# Altium project controller_V1.1.PrjPcb
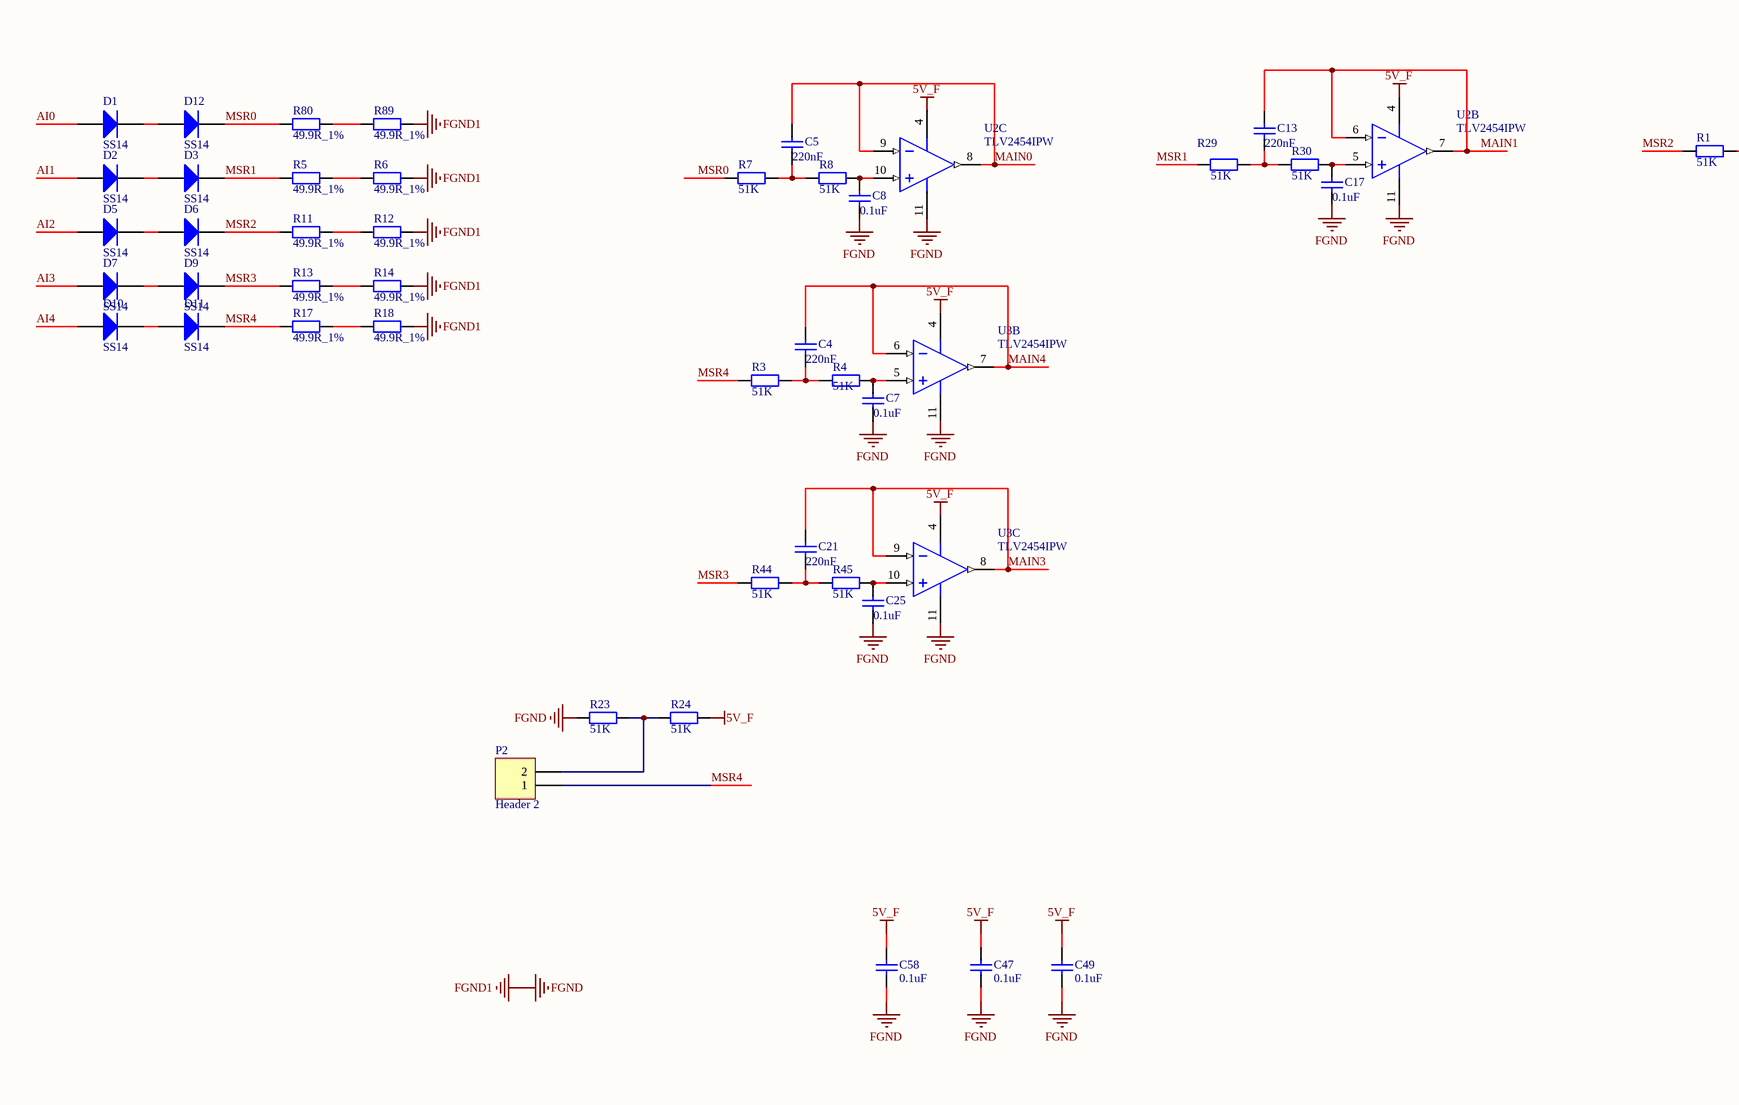
[diagram p0: ai.SchDoc, top left]
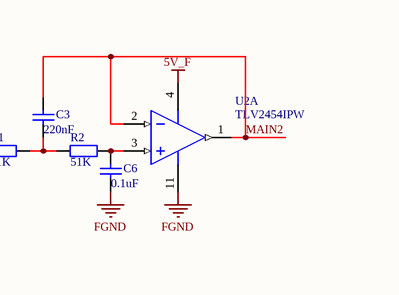
[diagram p1: ai.SchDoc, top right]
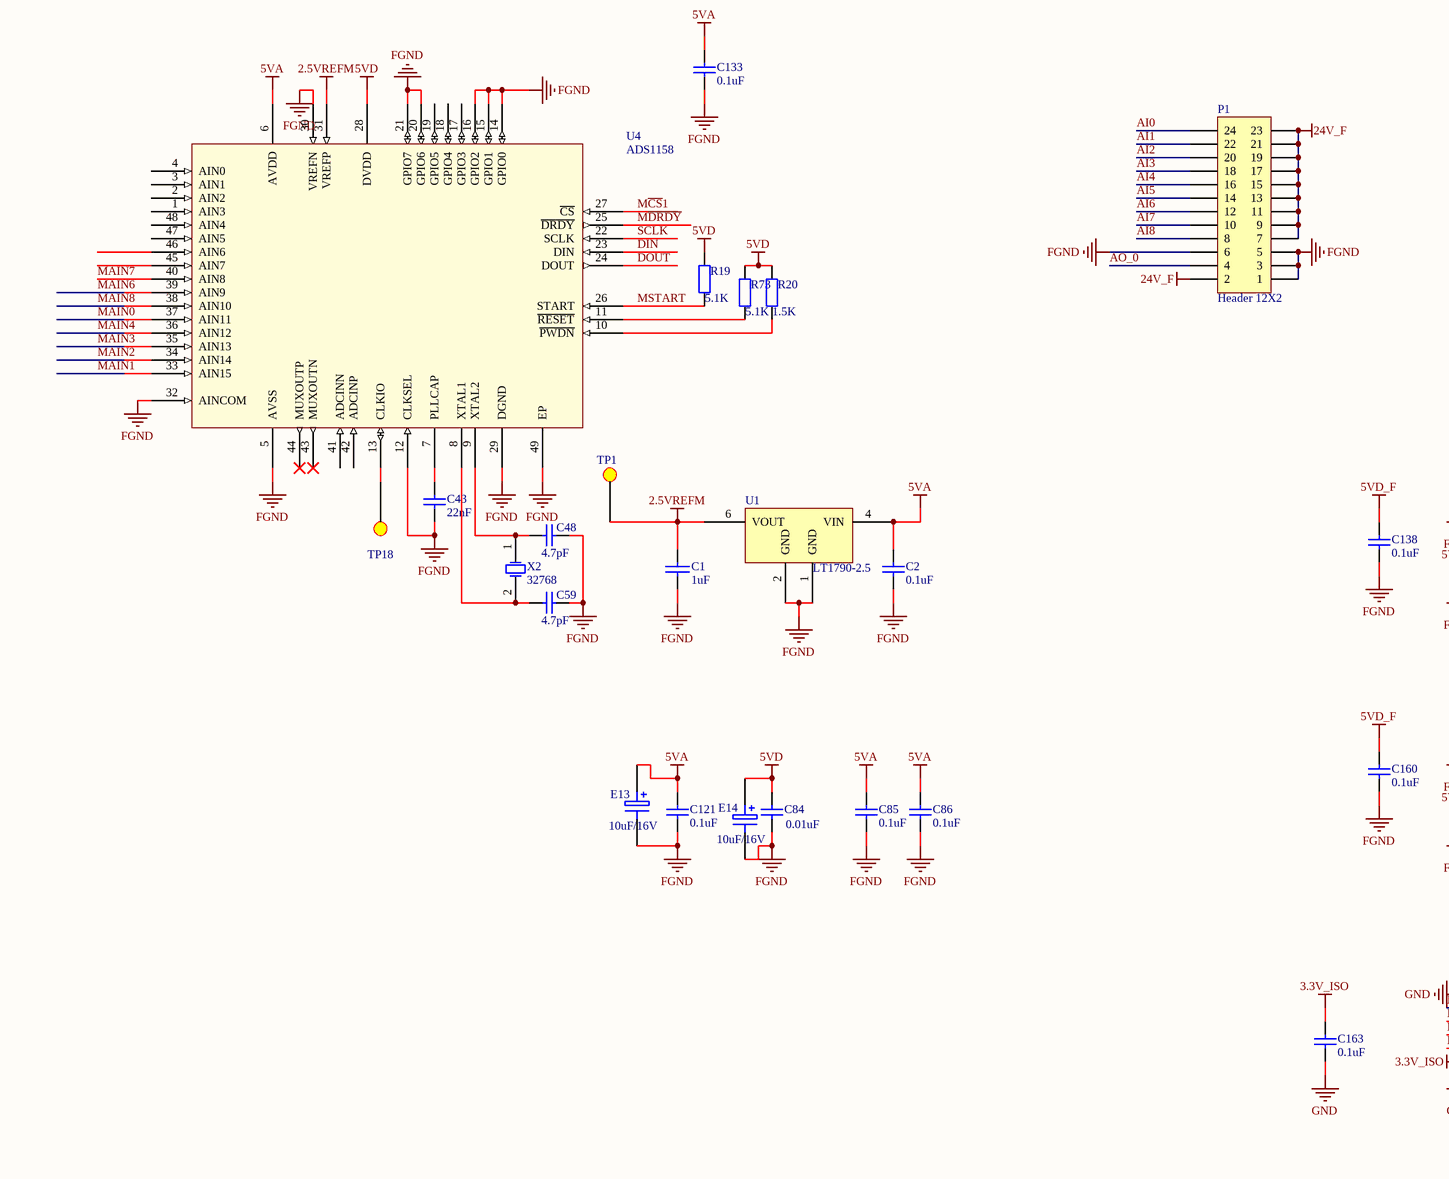
[diagram p2: ai.SchDoc, bottom left]
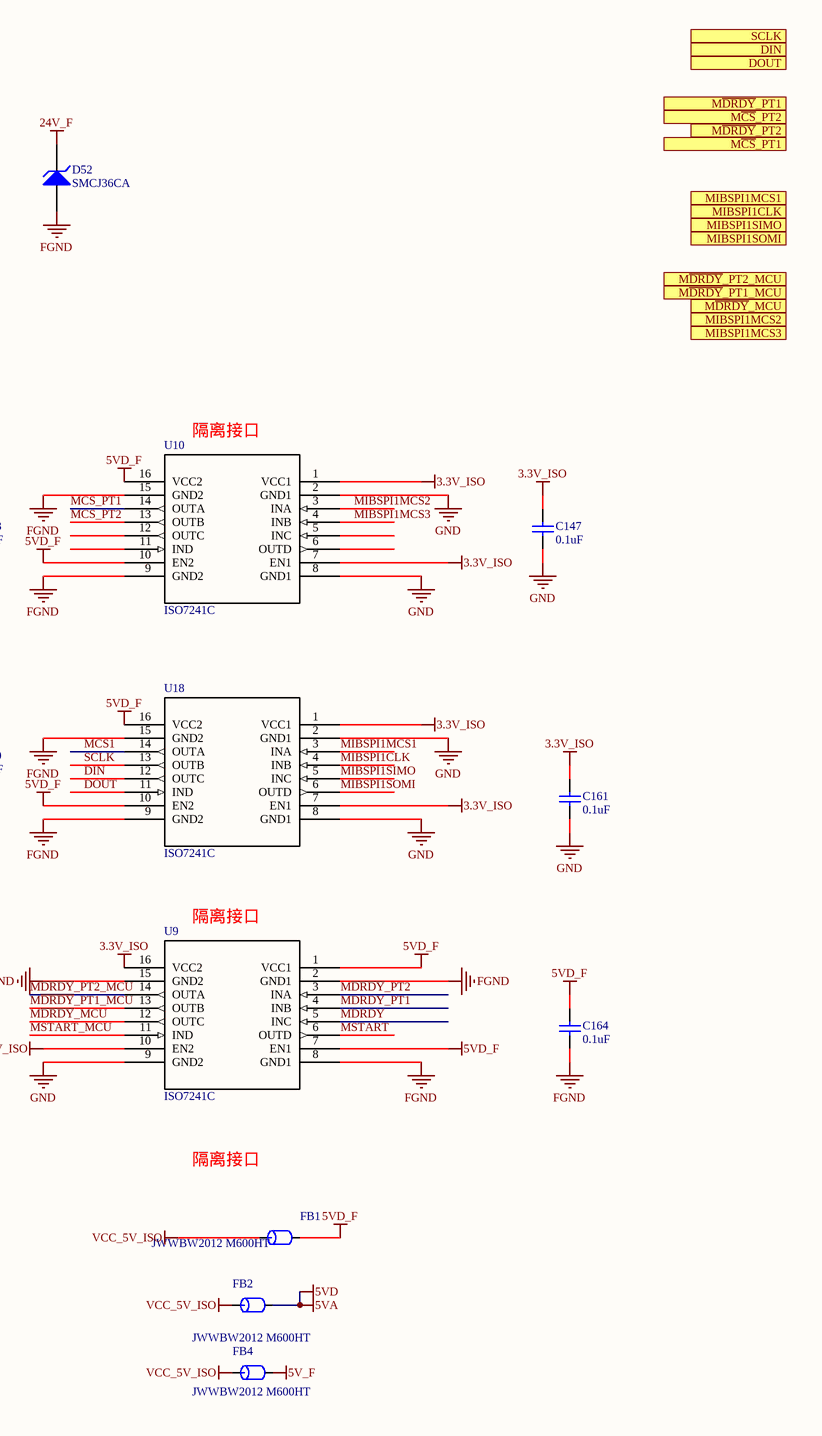
[diagram p3: ai.SchDoc, bottom right]
5 sheets, 182 parts. Net scope: global (net labels, ports and power ports of the same name join across sheets).
Board file: controller_V1.1.PcbDoc
Sheets:
  ai.SchDoc
  di.SchDoc
  IO_ctrl.SchDoc
  LTE.SchDoc
  power.SchDoc

## Sheet ai.SchDoc
size A1

### Parts
C1  1uF  [0603C]
C2  0.1uF  [0603C]
C3  220nF  [0805C]
C4  220nF  [0805C]
C5  220nF  [0805C]
C6  0.1uF  [0603C]
C7  0.1uF  [0603C]
C8  0.1uF  [0603C]
C13  220nF  [0805C]
C17  0.1uF  [0603C]
C21  220nF  [0805C]
C25  0.1uF  [0603C]
C43  22nF  [0805C]
C47  0.1uF  [0603C]
C48  4.7pF  [0603C]
C49  0.1uF  [0603C]
C58  0.1uF  [0603C]
C59  4.7pF  [0603C]
C84  0.01uF  [0603C]
C85  0.1uF  [0603C]
C86  0.1uF  [0603C]
C121  0.1uF  [0603C]
C133  0.1uF  [0603C]
C138  0.1uF  [0603C]
C147  0.1uF  [0603C]
C160  0.1uF  [0603C]
C161  0.1uF  [0603C]
C163  0.1uF  [0603C]
C164  0.1uF  [0603C]
D1  SS14  [DO-214AC]
D2  SS14  [DO-214AC]
D3  SS14  [DO-214AC]
D5  SS14  [DO-214AC]
D6  SS14  [DO-214AC]
D7  SS14  [DO-214AC]
D9  SS14  [DO-214AC]
D10  SS14  [DO-214AC]
D11  SS14  [DO-214AC]
D12  SS14  [DO-214AC]
D52  SMCJ36CA  [SMC]
E13  10uF/16V  [C3528]
E14  10uF/16V  [C3528]
FB1  JWWBW2012 M600HT  [0805R]
FB2  JWWBW2012 M600HT  [0805R]
FB4  JWWBW2012 M600HT  [0805R]
P1  Header 12X2  [XH2.54_2x12]
P2  Header 2  [HDR1X2]  (no BOM)
R1  51K  [0603R]
R2  51K  [0603R]
R3  51K  [0603R]
R4  51K  [0603R]
R5  49.9R_1%  [0805R]
R6  49.9R_1%  [0805R]
R7  51K  [0603R]
R8  51K  [0603R]
R11  49.9R_1%  [0805R]
R12  49.9R_1%  [0805R]
R13  49.9R_1%  [0805R]
R14  49.9R_1%  [0805R]
R17  49.9R_1%  [0805R]
R18  49.9R_1%  [0805R]
R19  5.1K  [0603R]
R20  1.5K  [0603R]
R23  51K  [0603R]
R24  51K  [0603R]
R29  51K  [0603R]
R30  51K  [0603R]
R44  51K  [0603R]
R45  51K  [0603R]
R73  5.1K  [0603R]
R80  49.9R_1%  [0805R]
R89  49.9R_1%  [0805R]
TP1  TEST_POINT  [TPD]  (value not drawn)
TP18  TEST_POINT  [TPD]  (value not drawn)
U1  LT1790-2.5  [SOT23-6]
U2  TLV2454IPW  [TSSOP14]  (parts A,B,C of 4)
U3  TLV2454IPW  [TSSOP14]  (parts B,C of 4)
U4  ADS1158  [S-PVFQN-N48]
U9  ISO7241C  [SOIC16]
U10  ISO7241C  [SOIC16]
U18  ISO7241C  [SOIC16]
X2  32768  [A]

### Ports
DIN (in), DOUT (out), MIBSPI1CLK (in), MIBSPI1MCS1 (in), MIBSPI1MCS2 (in), MIBSPI1MCS3 (in), MIBSPI1SIMO (in), MIBSPI1SOMI (out), M~{CS}_PT1 (out), M~{CS}_PT2 (out), M~{DRDY}_MCU (out), M~{DRDY}_PT1 (out), M~{DRDY}_PT1_MCU (out), M~{DRDY}_PT2 (out), M~{DRDY}_PT2_MCU (out), SCLK (in)

### Nets
2.5VREFM: C1.1 TP1.1 U1.6(VOUT) U4.31(VREFP)
3.3V_ISO: C147.2 C161.2 C163.2 U9.10(EN2) U9.16(VCC2) U10.1(VCC1) U10.7(EN1) U18.1(VCC1) U18.7(EN1)
5V_F: C47.2 C49.2 C58.2 FB4.2 R24.2 U2.4(V+) U3.4(V+)
5VA: C2.2 C84.2 C85.2 C86.2 C121.2 C133.2 E13.1 E14.1 FB2.2 R19.1 R20.1 R73.1 U1.4(VIN) U4.6(AVDD) U4.28(DVDD)  [also labelled 5VD]
5VD_F: C138.2 C160.2 C164.2 FB1.2 U9.1(VCC1) U9.7(EN1) U10.10(EN2) U10.16(VCC2) U18.10(EN2) U18.16(VCC2)
24V_F: D52.2(K) P1.2 P1.7 P1.9 P1.11 P1.13 P1.15 P1.17 P1.19 P1.21 P1.23
FGND: C1.2 C2.1 C6.1 C7.1 C8.1 C17.1 C25.1 C43.2 C47.1 C48.2 C49.1 C58.1 C59.2 C84.1 C85.1 C86.1 C121.1 C133.1 C138.1 C160.1 C164.1 D52.1(A) E13.2 E14.2 P1.1 P1.3 P1.5 P1.6 R6.1 R12.1 R14.1 R18.1 R23.1 R89.1 U1.1(GND) U1.2(GND) U2.11(GND) U3.11(GND) U4.5(AVSS) U4.12(CLKSEL) U4.14(GPIO0) U4.15(GPIO1) U4.16(GPIO2) U4.20(GPIO6) U4.21(GPIO7) U4.29(DGND) U4.30(VREFN) U4.32(AINCOM) U4.49(EP) U9.2(GND1) U9.8(GND1) U10.9(GND2) U10.15(GND2) U18.9(GND2) U18.15(GND2)  [also labelled FGND1]
GND: C147.1 C161.1 C163.1 U9.9(GND2) U9.15(GND2) U10.2(GND1) U10.8(GND1) U18.2(GND1) U18.8(GND1)
VCC_5V_ISO: FB1.1 FB2.1 FB4.1
AI0: D1.1(A) P1.24
AI1: D2.1(A) P1.22
AI2: D5.1(A) P1.20
AI3: D7.1(A) P1.18
AI4: D10.1(A) P1.16
AI5: P1.14
AI6: P1.12
AI7: P1.10
AI8: P1.8
AO_0: P1.4
DIN: U4.23(DIN) U18.12(OUTC)
DOUT: U4.24(DOUT) U18.11(IND)
MAIN0: C5.2 U2.8(OUT) U2.9(IN-) U4.37(AIN11)
MAIN1: C13.2 U2.6(IN-) U2.7(OUT) U4.33(AIN15)
MAIN2: C3.2 U2.1(OUT) U2.2(IN-) U4.34(AIN14)
MAIN3: C21.2 U3.8(OUT) U3.9(IN-) U4.35(AIN13)
MAIN4: C4.2 U3.6(IN-) U3.7(OUT) U4.36(AIN12)
MAIN6: U4.39(AIN9)
MAIN7: U4.40(AIN8)
MAIN8: U4.38(AIN10)
M~{CS}1: U4.27(~{CS}) U18.14(OUTA)
M~{CS}_PT1: U10.14(OUTA)
M~{CS}_PT2: U10.13(OUTB)
M~{DRDY}: U4.25(~{DRDY}) U9.5(INC)
M~{DRDY}_MCU: U9.12(OUTC)
M~{DRDY}_PT1: U9.4(INB)
M~{DRDY}_PT1_MCU: U9.13(OUTB)
M~{DRDY}_PT2: U9.3(INA)
M~{DRDY}_PT2_MCU: U9.14(OUTA)
MIBSPI1CLK: U18.4(INB)
MIBSPI1MCS1: U18.3(INA)
MIBSPI1MCS2: U10.3(INA)
MIBSPI1MCS3: U10.4(INB)
MIBSPI1SIMO: U18.5(INC)
MIBSPI1SOMI: U18.6(OUTD)
MSR0: D12.2(K) R7.2 R80.2
MSR1: D3.2(K) R5.2 R29.2
MSR2: D6.2(K) R1.2 R11.2
MSR3: D9.2(K) R13.2 R44.2
MSR4: D11.2(K) P2.1 R3.2 R17.2
MSTART: R19.2 U4.26(START) U9.6(OUTD)
MSTART_MCU: U9.11(IND)
SCLK: U4.22(SCLK) U18.13(OUTB)
NetC3_1: C3.1 R1.1 R2.2
NetC4_1: C4.1 R3.1 R4.2
NetC5_1: C5.1 R7.1 R8.2
NetC6_2: C6.2 R2.1 U2.3(IN+)
NetC7_2: C7.2 R4.1 U3.5(IN+)
NetC8_2: C8.2 R8.1 U2.10(IN+)
NetC13_1: C13.1 R29.1 R30.2
NetC17_2: C17.2 R30.1 U2.5(IN+)
NetC21_1: C21.1 R44.1 R45.2
NetC25_2: C25.2 R45.1 U3.10(IN+)
NetC43_1: C43.1 U4.7(PLLCAP)
NetC48_1: C48.1 U4.9(XTAL2) X2.1(OSC1)
NetC59_1: C59.1 U4.8(XTAL1) X2.2(OSC2)
NetD1_2: D1.2(K) D12.1(A)
NetD2_2: D2.2(K) D3.1(A)
NetD5_2: D5.2(K) D6.1(A)
NetD7_2: D7.2(K) D9.1(A)
NetD10_2: D10.2(K) D11.1(A)
NetP2_2: P2.2 R23.2 R24.1
NetR5_1: R5.1 R6.2
NetR11_1: R11.1 R12.2
NetR13_1: R13.1 R14.2
NetR17_1: R17.1 R18.2
NetR20_2: R20.2 U4.10(~{PWDN})
NetR73_2: R73.2 U4.11(~{RESET})
NetR80_1: R80.1 R89.2
NetTP18_1: TP18.1 U4.13(CLKIO)

Not connected (* = marked no-connect by the designer): U1 3(DNC) 5(DNC); U4 1(AIN3) 2(AIN2) 3(AIN1) 4(AIN0) 17(GPIO3) 18(GPIO4) 19(GPIO5) 41(ADCINN) 42(ADCINP) 43(MUXOUTN)* 44(MUXOUTP)* 45(AIN7) 46(AIN6) 47(AIN5) 48(AIN4); U10 5(INC) 6(OUTD) 11(IND) 12(OUTC)

### Notes on the sheet
- (near U10) 隔离接口
- (near U9) 隔离接口
- 隔离接口

### Library data of the parts
C1 = CAP: Capacitor
C2-C8 C13 C17 C21 C25 C43 C47-C49 C58 C84-C86 C121 C133 C138 C147 C160 C161 C163 C164 = Cap: Capacitor; Published: 8-Jun-2000; LatestRevisionDate: 17-Jul-2002; LatestRevisionNote: Re-released for DXP Platform.; PackageReference: RAD-0.3; Publisher: Altium Limited; PackageDescription: Radial Cap, Thru-Hole; 2 Leads; 0.3 in Pin Spacing
  C2 C47 C49 C58 C85 C86 C121 C133 C138 C147 C160 C161 C163 C164: Value: 0.1uF
C59 = Cap: Capacitor; Value: 6.8pF; Published: 8-Jun-2000; LatestRevisionDate: 17-Jul-2002; LatestRevisionNote: Re-released for DXP Platform.; PackageReference: RAD-0.3; Publisher: Altium Limited; PackageDescription: Radial Cap, Thru-Hole; 2 Leads; 0.3 in Pin Spacing
D1-D3 D5-D7 D9-D12 = Diode: Default Diode; Published: 8-Jun-2000; LatestRevisionDate: 17-Jul-2002; LatestRevisionNote: Re-released for DXP Platform.; PackageVersion: Sep-1996; PackageReference: SMC; Publisher: Altium Limited; Code_JEDEC: DO-214-AB
D52 = D Zener: SMBJ36CA; Published: 8-Jun-2000; LatestRevisionDate: 17-Jul-2002; LatestRevisionNote: Re-released for DXP Platform.; PackageReference: DIODE-0.7; Publisher: Altium Limited
E13 E14 = ELECTRO1: Electrolytic Capacitor
FB1 FB2 FB4 = FB: Part Field 1: 磁珠/0603/1K ohm/100MHz; FB: BLM18BD102SN1(muRata); Text Field1: FB
P1 = Header 12X2: Header, 12-Pin, Dual row; LatestRevisionDate: 17-Jul-2002; LatestRevisionNote: Re-released for DXP Platform.; Publisher: Altium Limited
P2 = Header 2: Header, 2-Pin; LatestRevisionDate: 17-Jul-2002; LatestRevisionNote: Re-released for DXP Platform.; Publisher: Altium Limited
R1-R8 R11-R14 R17-R20 R23 R24 R29 R30 R44 R45 R73 R80 R89 = Res0805M
U1 = LT1790-2.5: 2.5V Micropower SOT-23  Low Dropout Reference
U2 U3 = MAX908EPD: Quad High-speed, Ultra Low-power, Single-Supply TTL comparator; Published: 16-Jan-2001; LatestRevisionDate: 29-May-2009; LatestRevisionNote: Component Body Added.; DatasheetVersion: Jul-1994; PackageVersion: RevB, 21-0043; PackageReference: PD14; Publisher: Altium Limited; PackageDescription: DIP, 14-Pin, Row Spacing 7.62 mm, Pitch 2.54 mm; Code_JEDEC: MS-001-AC; ComponentLink1Description: Manufacturer Link; ComponentLink1URL: http://www.maxim-ic.com/; ComponentLink2Description: Datasheet; ComponentLink2URL: http://pdfserv.maxim-ic.com/en/ds/MAX907-MAX909.pdf
U4 = ADS1158: 16-Channel, 16-Bit Analog-to-Digital Converter
X2 = XTAL: Crystal Oscillator; Published: 8-Jun-2000; LatestRevisionDate: 17-Jul-2002; LatestRevisionNote: Re-released for DXP Platform.; PackageReference: R38; Publisher: Altium Limited

## Sheet di.SchDoc
size A2
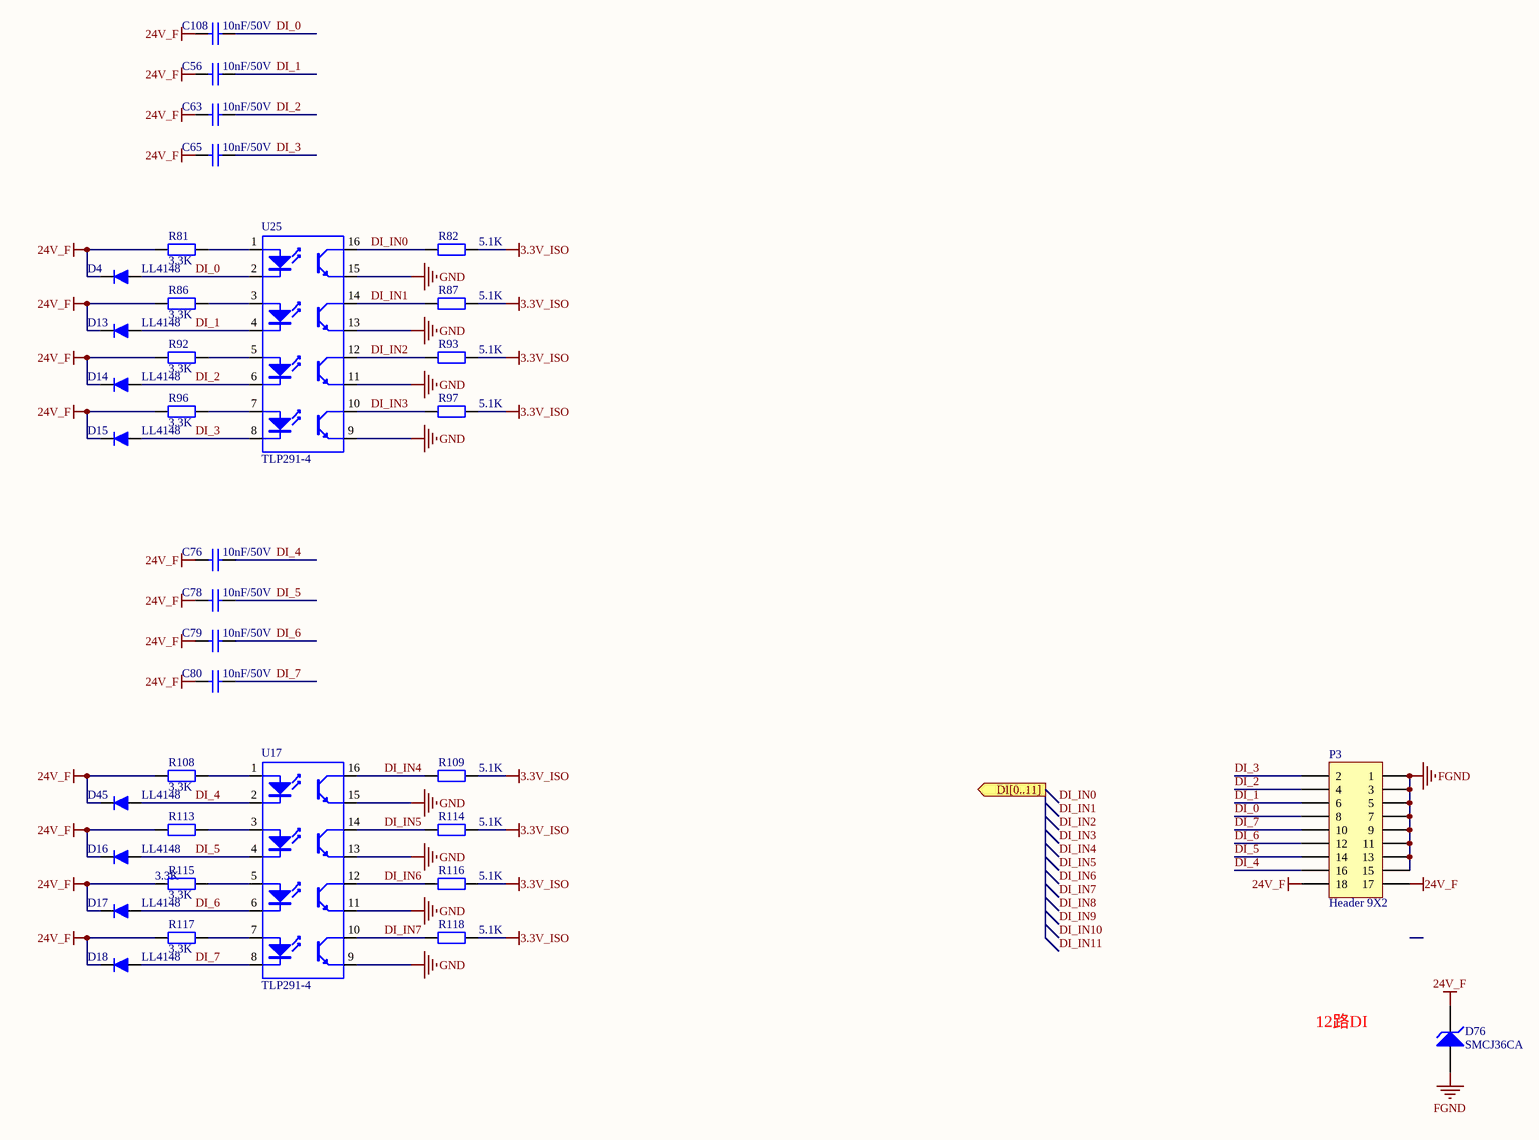
[diagram p4: di.SchDoc]

### Parts
C56  10nF/50V  [0603C]
C63  10nF/50V  [0603C]
C65  10nF/50V  [0603C]
C76  10nF/50V  [0603C]
C78  10nF/50V  [0603C]
C79  10nF/50V  [0603C]
C80  10nF/50V  [0603C]
C108  10nF/50V  [0603C]
D4  LL4148  [DO-213AB/LL34/MiniMELF]
D13  LL4148  [DO-213AB/LL34/MiniMELF]
D14  LL4148  [DO-213AB/LL34/MiniMELF]
D15  LL4148  [DO-213AB/LL34/MiniMELF]
D16  LL4148  [DO-213AB/LL34/MiniMELF]
D17  LL4148  [DO-213AB/LL34/MiniMELF]
D18  LL4148  [DO-213AB/LL34/MiniMELF]
D45  LL4148  [DO-213AB/LL34/MiniMELF]
D76  SMCJ36CA  [smc]
P3  Header 9X2  [XH2.54_2x9]
R81  3.3K  [0603R]
R82  5.1K  [0603R]
R86  3.3K  [0603R]
R87  5.1K  [0603R]
R92  3.3K  [0603R]
R93  5.1K  [0603R]
R96  3.3K  [0603R]
R97  5.1K  [0603R]
R108  3.3K  [0603R]
R109  5.1K  [0603R]
R113  3.3K  [0603R]
R114  5.1K  [0603R]
R115  3.3K  [0603R]
R116  5.1K  [0603R]
R117  3.3K  [0603R]
R118  5.1K  [0603R]
U17  TLP291-4  [SOP16-T]
U25  TLP291-4  [SOP16-T]

### Ports
DI[0..11] (out)

### Nets
3.3V_ISO: R82.1 R87.1 R93.1 R97.1 R109.1 R114.1 R116.1 R118.1
24V_F: C56.1 C63.1 C65.1 C76.1 C78.1 C79.1 C80.1 C108.1 D4.2 D13.2 D14.2 D15.2 D16.2 D17.2 D18.2 D45.2 D76.2(K) P3.17 P3.18 R81.2 R86.2 R92.2 R96.2 R108.2 R113.2 R115.2 R117.2
FGND: D76.1(A) P3.1 P3.3 P3.5 P3.7 P3.9 P3.11 P3.13 P3.15
GND: U17.9(E) U17.11(E) U17.13(E) U17.15(E) U25.9(E) U25.11(E) U25.13(E) U25.15(E)
DI_0: C108.2 D4.1 P3.8 U25.2(K)
DI_1: C56.2 D13.1 P3.6 U25.4(K)
DI_2: C63.2 D14.1 P3.4 U25.6(K)
DI_3: C65.2 D15.1 P3.2 U25.8(K)
DI_4: C76.2 D45.1 P3.16 U17.2(K)
DI_5: C78.2 D16.1 P3.14 U17.4(K)
DI_6: C79.2 D17.1 P3.12 U17.6(K)
DI_7: C80.2 D18.1 P3.10 U17.8(K)
DI_IN0: R82.2 U25.16(C)
DI_IN1: R87.2 U25.14(C)
DI_IN2: R93.2 U25.12(C)
DI_IN3: R97.2 U25.10(C)
DI_IN4: R109.2 U17.16(C)
DI_IN5: R114.2 U17.14(C)
DI_IN6: R116.2 U17.12(C)
DI_IN7: R118.2 U17.10(C)
NetR81_1: R81.1 U25.1(A)
NetR86_1: R86.1 U25.3(A)
NetR92_1: R92.1 U25.5(A)
NetR96_1: R96.1 U25.7(A)
NetR108_1: R108.1 U17.1(A)
NetR113_1: R113.1 U17.3(A)
NetR115_1: R115.1 U17.5(A)
NetR117_1: R117.1 U17.7(A)

### Notes on the sheet
- 12路DI
- Labels drawn without touching a wire or pin: DI_IN0, DI_IN1, DI_IN2, DI_IN3, DI_IN4, DI_IN5, DI_IN6, DI_IN7, DI_IN8, DI_IN9, DI_IN10, DI_IN11

### Library data of the parts
C56 C63 C65 C76 C78-C80 C108 = Cap: Capacitor; Value: 22nF; Published: 8-Jun-2000; LatestRevisionDate: 17-Jul-2002; LatestRevisionNote: Re-released for DXP Platform.; PackageReference: RAD-0.3; Publisher: Altium Limited; PackageDescription: Radial Cap, Thru-Hole; 2 Leads; 0.3 in Pin Spacing
D4 D13-D18 D45 = LL4148: VISHAY,LL4148,圆柱体MiniMELF100V/2A,ROHS; 版本: V1.00; 名称: 快速开关二极管; 物料编号: APLLY; 制造商: VISHAY
D76 = D Zener: SMBJ36CA; Published: 8-Jun-2000; LatestRevisionDate: 17-Jul-2002; LatestRevisionNote: Re-released for DXP Platform.; PackageReference: DIODE-0.7; Publisher: Altium Limited
P3 = Header 9X2: Header, 9-Pin, Dual row; LatestRevisionDate: 17-Jul-2002; LatestRevisionNote: Re-released for DXP Platform.; Publisher: Altium Limited
R81 R82 R86 R87 R92 R93 R96 R97 R108 R109 R113-R118 = Res0805M
U17 U25 = TLP281-4

## Sheet IO_ctrl.SchDoc
size A3
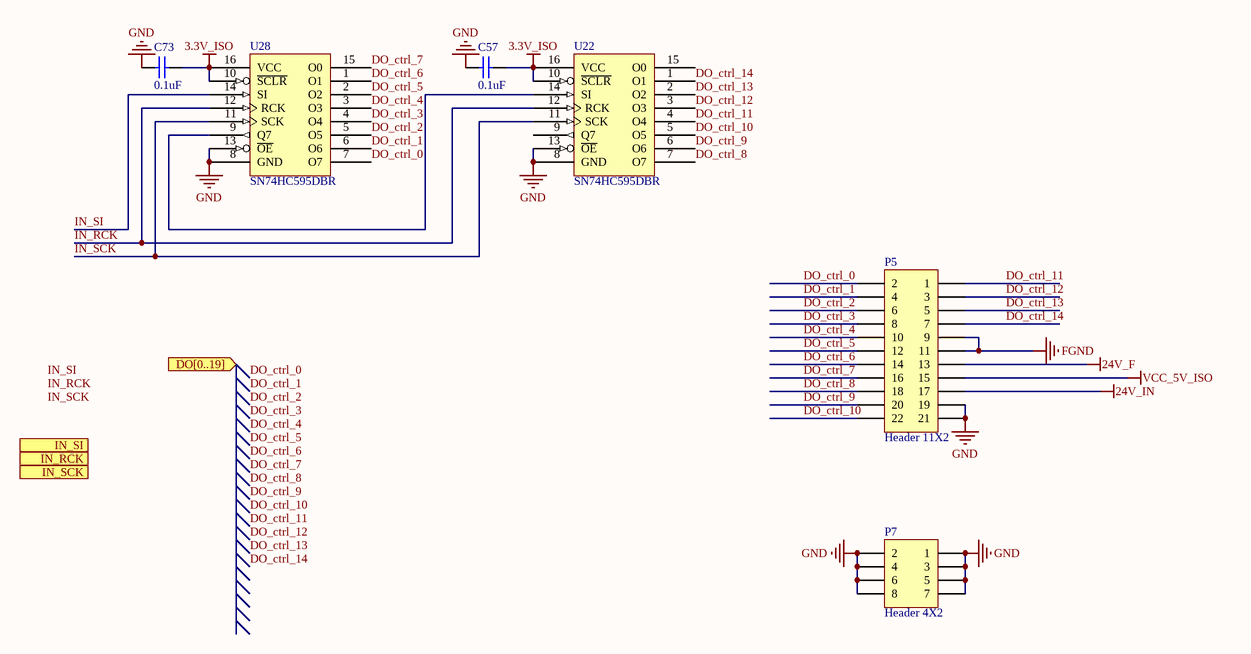
[diagram p5: IO_ctrl.SchDoc]

### Parts
C57  0.1uF  [0603C]
C73  0.1uF  [0603C]
P5  Header 11X2  [HDR2X11]
P7  Header 4X2  [HDR2X4]
U22  SN74HC595DBR  [SSOP16]
U28  SN74HC595DBR  [SSOP16]

### Ports
DO[0..19] (in), IN_RCK (in), IN_SCK (in), IN_SI (in)

### Nets
3.3V_ISO: C57.1 C73.1 U22.10(~{SCLR}) U22.16(VCC) U28.10(~{SCLR}) U28.16(VCC)
24V_F: P5.13
24V_IN: P5.17
FGND: P5.9 P5.11
GND: C57.2 C73.2 P5.19 P5.21 P7.1 P7.2 P7.3 P7.4 P7.5 P7.6 P7.7 P7.8 U22.8(GND) U22.13(~{OE}) U28.8(GND) U28.13(~{OE})
VCC_5V_ISO: P5.15
DO_ctrl_0: P5.2 U28.7(O7)
DO_ctrl_1: P5.4 U28.6(O6)
DO_ctrl_2: P5.6 U28.5(O5)
DO_ctrl_3: P5.8 U28.4(O4)
DO_ctrl_4: P5.10 U28.3(O3)
DO_ctrl_5: P5.12 U28.2(O2)
DO_ctrl_6: P5.14 U28.1(O1)
DO_ctrl_7: P5.16 U28.15(O0)
DO_ctrl_8: P5.18 U22.7(O7)
DO_ctrl_9: P5.20 U22.6(O6)
DO_ctrl_10: P5.22 U22.5(O5)
DO_ctrl_11: P5.1 U22.4(O4)
DO_ctrl_12: P5.3 U22.3(O3)
DO_ctrl_13: P5.5 U22.2(O2)
DO_ctrl_14: P5.7 U22.1(O1)
IN_RCK: U22.12(RCK) U28.12(RCK)
IN_SCK: U22.11(SCK) U28.11(SCK)
IN_SI: U28.14(SI)
NetU22_14: U22.14(SI) U28.9(Q7)

Not connected (* = marked no-connect by the designer): U22 9(Q7) 15(O0)

### Notes on the sheet
- Labels drawn without touching a wire or pin: DO_ctrl_0, DO_ctrl_1, DO_ctrl_2, DO_ctrl_3, DO_ctrl_4, DO_ctrl_5, DO_ctrl_6, DO_ctrl_7, DO_ctrl_8, DO_ctrl_9, DO_ctrl_10, DO_ctrl_11, DO_ctrl_12, DO_ctrl_13, DO_ctrl_14, IN_RCK, IN_SCK, IN_SI

### Library data of the parts
C57 C73 = Cap: Capacitor; Published: 8-Jun-2000; LatestRevisionDate: 17-Jul-2002; LatestRevisionNote: Re-released for DXP Platform.; PackageReference: RAD-0.3; Publisher: Altium Limited; PackageDescription: Radial Cap, Thru-Hole; 2 Leads; 0.3 in Pin Spacing; Value: 0.1uF
P5 = Header 11X2: Header, 11-Pin, Dual row; LatestRevisionDate: 17-Jul-2002; LatestRevisionNote: Re-released for DXP Platform.; Publisher: Altium Limited
P7 = Header 4X2: Header, 4-Pin, Dual row; LatestRevisionDate: 17-Jul-2002; LatestRevisionNote: Re-released for DXP Platform.; Publisher: Altium Limited
U22 U28 = 74HC595

## Sheet LTE.SchDoc
size A3
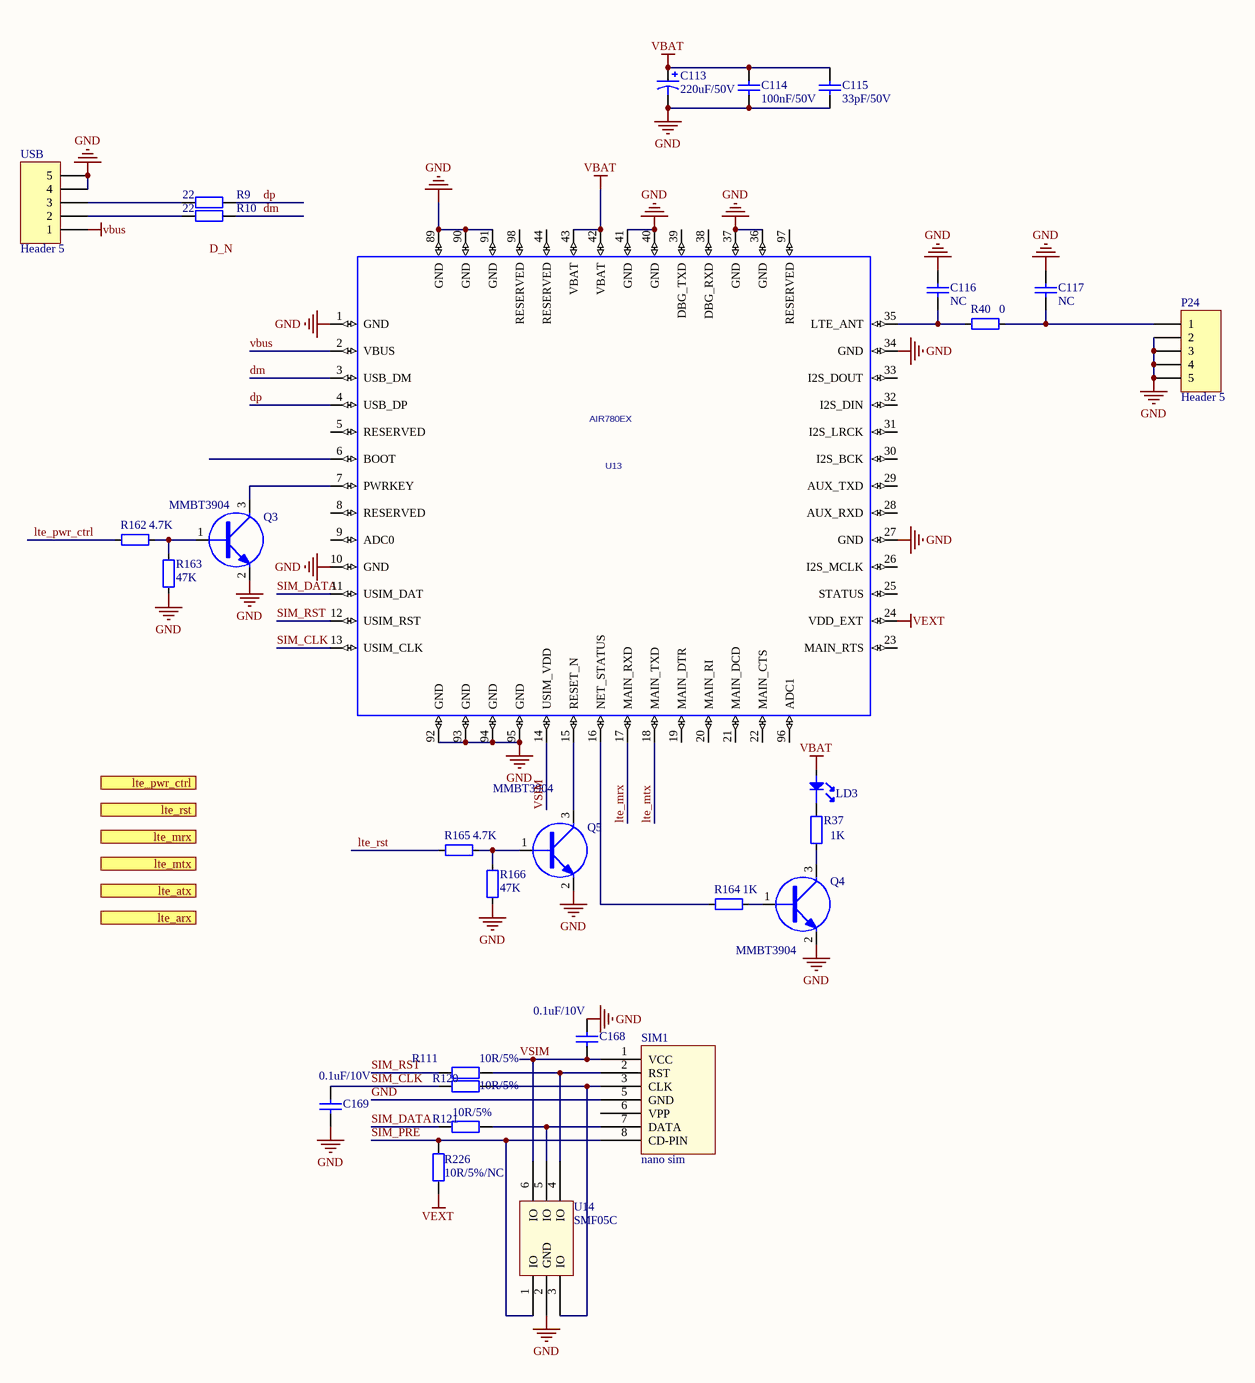
[diagram p6: LTE.SchDoc]

### Parts
C113  220uF/50V  [Φ10×10]
C114  100nF/50V  [0603C]
C115  33pF/50V  [0603C]
C116  NC  [0603c]
C117  NC  [0603c]
C168  0.1uF/10V  [0603c]
C169  0.1uF/10V  [0603c]  (no BOM)
LD3  LED_Green_19-217  [0603led]  (value not drawn)
P24  Header 5  [KH-SMA-KE-Z]
Q3  MMBT3904  [SOT23-3]
Q4  MMBT3904  [SOT23-3]
Q5  MMBT3904  [SOT23-3]
R9  22  [0402R]
R10  22  [0402R]
R37  1K  [0603R]
R40  0  [0603r]
R111  10R/5%  [0603r]
R120  10R/5%  [0603r]
R121  10R/5%  [0603r]
R162  4.7K  [0603R]
R163  47K  [0603r]
R164  1K  [0603r]
R165  4.7K  [0603R]
R166  47K  [0603r]
R226  10R/5%/NC  [0603r]
SIM1  nano sim  [Nano SIM]
U13  AIR780EX  [AIR780EX]
U14  SMF05C  [sc70-6l]
USB  Header 5  [USB-MICRO-5P]  (no BOM)

### Ports
lte_arx, lte_atx, lte_mrx, lte_mtx, lte_pwr_ctrl, lte_rst

### Nets
GND: C113.2 C114.1 C115.1 C116.2 C117.2 C168.1 C169.2 P24.2 P24.3 P24.4 P24.5 Q3.2(E) Q4.2(E) Q5.2(E) R163.1 R166.1 SIM1.5(GND) U13.1(GND) U13.10(GND) U13.27(GND) U13.34(GND) U13.36(GND) U13.37(GND) U13.40(GND) U13.41(GND) U13.89(GND) U13.90(GND) U13.91(GND) U13.92(GND) U13.93(GND) U13.94(GND) U13.95(GND) U14.2(GND) USB.4 USB.5
VBAT: C113.1 C114.2 C115.2 LD3.1 U13.42(VBAT) U13.43(VBAT)
vbus: U13.2(VBUS) USB.1
VEXT: R226.2 U13.24(VDD_EXT)
dm: R10.2 U13.3(USB_DM)
dp: R9.2 U13.4(USB_DP)
lte_mrx: U13.17(MAIN_RXD)
lte_mtx: U13.18(MAIN_TXD)
lte_pwr_ctrl: R162.1
lte_rst: R165.1
SIM_CLK: C169.1 R120.2 U13.13(USIM_CLK)
SIM_DATA: R121.2 U13.11(USIM_DAT)
SIM_PRE: R226.1 SIM1.8(CD-PIN) U14.1(IO)
SIM_RST: R111.2 U13.12(USIM_RST)
VSIM: C168.2 SIM1.1(VCC) U13.14(USIM_VDD) U14.6(IO)
NetC116_1: C116.1 R40.1 U13.35(LTE_ANT)
NetC117_1: C117.1 P24.1 R40.2
NetLD3_2: LD3.2 R37.1
NetQ3_1: Q3.1(B) R162.2 R163.2
NetQ3_3: Q3.3(C) U13.7(PWRKEY)
NetQ4_1: Q4.1(B) R164.2
NetQ4_3: Q4.3(C) R37.2
NetQ5_1: Q5.1(B) R165.2 R166.2
NetQ5_3: Q5.3(C) U13.15(RESET_N)
NetR9_1: R9.1 USB.3
NetR10_1: R10.1 USB.2
NetR111_1: R111.1 SIM1.2(RST) U14.4(IO)
NetR120_1: R120.1 SIM1.3(CLK) U14.3(IO)
NetR121_1: R121.1 SIM1.7(DATA) U14.5(IO)
NetR164_1: R164.1 U13.16(NET_STATUS)

Not connected (* = marked no-connect by the designer): SIM1 6(VPP); U13 5(RESERVED) 6(BOOT) 8(RESERVED) 9(ADC0) 19(MAIN_DTR) 20(MAIN_RI) 21(MAIN_DCD) 22(MAIN_CTS) 23(MAIN_RTS) 25(STATUS) 26(I2S_MCLK) 28(AUX_RXD) 29(AUX_TXD) 30(I2S_BCK) 31(I2S_LRCK) 32(I2S_DIN) 33(I2S_DOUT) 38(DBG_RXD) 39(DBG_TXD) 44(RESERVED) 96(ADC1) 97(RESERVED) 98(RESERVED)

### Notes on the sheet
- Labels drawn without touching a wire or pin: D_N

### Library data of the parts
C113 = Cap Pol1: Polarized Capacitor (Radial); Value: 100pF; Published: 8-Jun-2000; LatestRevisionDate: 17-Jul-2002; LatestRevisionNote: Re-released for DXP Platform.; PackageReference: RB7.6-15; Publisher: Altium Limited
C114-C117 = Cap: Capacitor; Value: 22nF; Published: 8-Jun-2000; LatestRevisionDate: 17-Jul-2002; LatestRevisionNote: Re-released for DXP Platform.; PackageReference: RAD-0.3; Publisher: Altium Limited; PackageDescription: Radial Cap, Thru-Hole; 2 Leads; 0.3 in Pin Spacing
C168 C169 = Cap: Capacitor; Published: 8-Jun-2000; LatestRevisionDate: 17-Jul-2002; LatestRevisionNote: Re-released for DXP Platform.; PackageReference: RAD-0.3; Publisher: Altium Limited; Value: 0.1uF/10V
LD3 = LED_Green_19-217: 物料主编码(PN): 100000032; Value: 19-217/G7C-AN1P2/3T; ID: 6; 序号: 33; 物料名称: 绿色LED; 物料描述: Other,LED,绿色,0603,1.6X0.8X0.4mm,19-217/G7C-AN1P2/3T; 工作温度: –40°C to 85°C; 制造商: Everlight; 器件等级: ——; 物料类型: 特殊二极管; 规格型号(完整型号): 19-217/G7C-AN1P2/3T
P24 USB = Header 5: Header, 5-Pin; LatestRevisionDate: 17-Jul-2002; LatestRevisionNote: Re-released for DXP Platform.; Publisher: Altium Limited
Q3-Q5 = NPN_MMBT3904
R9 R10 = Resistor: Resistor SMD - IEC symbol version; Value: NC; LatestRevisionDate: 27-Jul-20  -  Semtech
R37 R164 = RES0603: 物料主编码(PN): 150000040; ID: 233; 序号: 109; 物料名称: 贴片电阻; 精度: ±1%; 规格型号(完整型号): RC1608F103CS/RC0603FR-0710KL; 物料描述: RES,贴片电阻,0603,10k,±1%,1/10W,1.6X0.8X0.45mm,RC1608F103CS/RC0603FR-0710KL; 工作温度: –55°C to 155°C; 制造商: 三星/YAGEO; 器件等级: ——; 物料类型: 表贴电阻; 参数值: 1.00E+04; Value: 1K
R40 R162 R163 R165 R166 = RES0603: 物料主编码(PN): 150000040; Value: 1K; ID: 233; 序号: 109; 物料名称: 贴片电阻; 精度: ±1%; 规格型号(完整型号): RC1608F103CS/RC0603FR-0710KL; 物料描述: RES,贴片电阻,0603,10k,±1%,1/10W,1.6X0.8X0.45mm,RC1608F103CS/RC0603FR-0710KL; 工作温度: –55°C to 155°C; 制造商: 三星/YAGEO; 器件等级: ——; 物料类型: 表贴电阻; 参数值: 1.00E+04
R111 R120 R121 R226 = Res2: Resistor; Value: 10R; Published: 8-Jun-2000; LatestRevisionDate: 17-Jul-2002; LatestRevisionNote: Re-released for DXP Platform.; PackageReference: AXIAL-0.4; Publisher: Altium Limited
U13 = AIR780EX: PCB DECAL: AIR780EX

## Sheet power.SchDoc
size A2
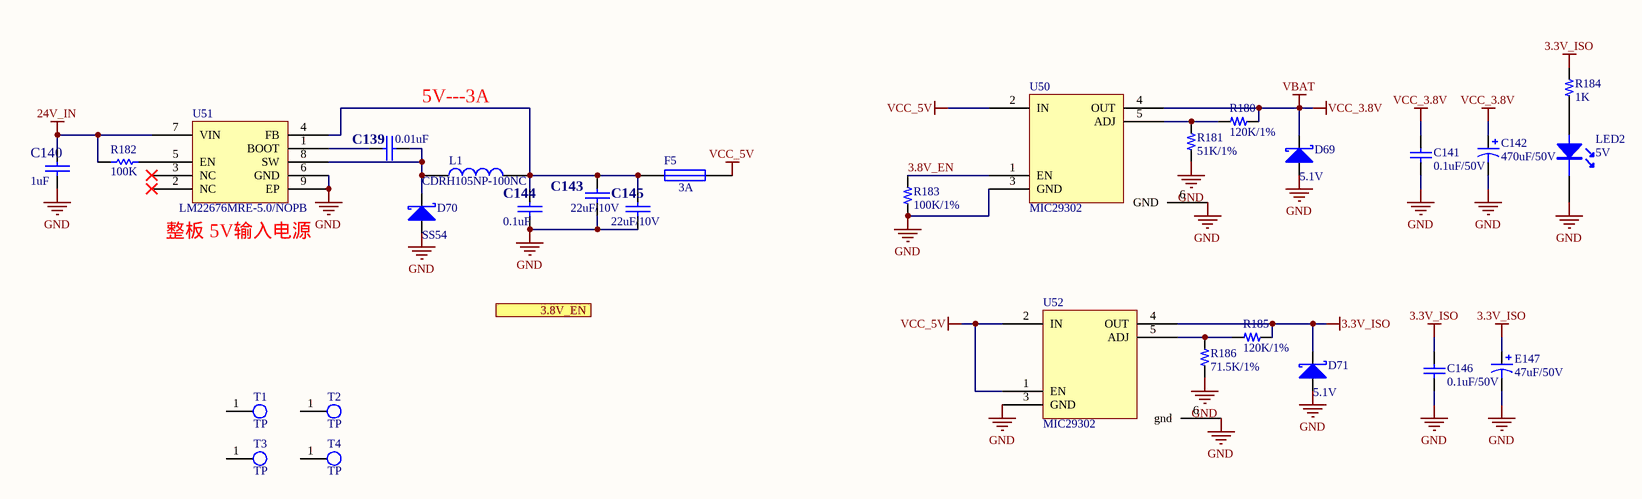
[diagram p7: power.SchDoc]

### Parts
C139  0.01uF  [0603C]
C140  1uF  [0603C]
C141  0.1uF/50V  [0603C]
C142  470uF/50V  [Φ10×10]
C143  22uF/10V  [1210C]
C144  0.1uF  [0603C]
C145  22uF/10V  [1210C]
C146  0.1uF/50V  [0603C]
D69  5.1V  [SMA]
D70  SS54  [SMC]
D71  5.1V  [SMA]
E147  47uF/50V  [Φ10×10]
F5  3A  [1812-F]
L1  CDRH105NP-100NC  [CDRH105]
LED2  5V  [0603LED]
R180  120K/1%  [0603R]
R181  51K/1%  [0603R]
R182  100K  [0603R]
R183  100K/1%  [0603R]
R184  1K  [0603R]
R185  120K/1%  [0603R]
R186  71.5K/1%  [0603R]
T1  TP  [M3]
T2  TP  [M3]
T3  TP  [M3]
T4  TP  [M3]
U50  MIC29302  [TO228P1435X457-6N]
U51  LM22676MRE-5.0/NOPB  [SOP127P600X168_HS-8N]
U52  MIC29302  [TO228P1435X457-6N]

### Ports
3.8V_EN (in)

### Nets
3.3V_ISO: C146.2 D71.2(K) E147.1 R184.2 R185.1 U52.4(OUT)
24V_IN: C140.2 R182.2 U51.7(VIN)
GND: C140.1 C141.1 C142.2 C143.2 C144.2 C145.2 C146.1 D69.1(A) D70.1(A) D71.1(A) E147.2 LED2.2 R181.1 R183.1 R186.1 U50.3(GND) U50.6(GND) U51.6(GND) U51.9(EP) U52.3(GND) U52.6(gnd)
VBAT: C141.2 C142.1 D69.2(K) R180.1 U50.4(OUT)  [also labelled VCC_3.8V]
VCC_5V: F5.2 U50.2(IN) U52.1(EN) U52.2(IN)
3.8V_EN: R183.2 U50.1(EN)
NetC139_1: C139.1 D70.2(K) L1.1 U51.8(SW)
NetC139_2: C139.2 U51.1(BOOT)
NetC143_1: C143.1 C144.1 C145.1 F5.1 L1.2 U51.4(FB)
NetLED2_1: LED2.1 R184.1
NetR180_2: R180.2 R181.2 U50.5(ADJ)
NetR182_1: R182.1 U51.5(EN)
NetR185_2: R185.2 R186.2 U52.5(ADJ)

Not connected (* = marked no-connect by the designer): T1 1; T2 1; T3 1; T4 1; U51 2(NC)* 3(NC)*

### Notes on the sheet
- 5V---3A
- (near U51) 整板 5V输入电源

### Library data of the parts
C139 C140 C143-C145 = CAP: Capacitor
C141 C146 = Cap: Capacitor; Value: 22nF; Published: 8-Jun-2000; LatestRevisionDate: 17-Jul-2002; LatestRevisionNote: Re-released for DXP Platform.; PackageReference: RAD-0.3; Publisher: Altium Limited; PackageDescription: Radial Cap, Thru-Hole; 2 Leads; 0.3 in Pin Spacing
C142 E147 = Cap Pol1: as C113 on sheet LTE; Published: 8-Jun-2000; LatestRevisionDate: 17-Jul-2002; LatestRevisionNote: Re-released for DXP Platform.; PackageReference: RB7.6-15; Publisher: Altium Limited
D69-D71 = DIODE S: Schottky Diode
F5 = Fuse 1: Fuse; Published: 8-Jun-2000; LatestRevisionDate: 17-Jul-2002; LatestRevisionNote: Re-released for DXP Platform.; PackageReference: PIN-W2/E2.8; Publisher: Altium Limited; PackageDescription: Thru-Hole; 2 Leads
L1 = INDUCTOR
LED2 = LED
R180 R181 R183-R186 = R
R182 = Res1: Resistor; Published: 8-Jun-2000; LatestRevisionDate: 17-Jul-2002; LatestRevisionNote: Re-released for DXP Platform.; PackageReference: AXIAL-0.3; Publisher: Altium Limited
U51 = LM22676MR-5.0

## Nets that join several sheets
3.3V_ISO: ai (9 pins), di (8 pins), IO_ctrl (6 pins), power (6 pins)
24V_F: ai (11 pins), di (27 pins), IO_ctrl (P5.13)
24V_IN: IO_ctrl (P5.17), power (C140.2 R182.2 U51.7)
FGND: ai (55 pins), di (9 pins), IO_ctrl (P5.9 P5.11)
GND: ai (9 pins), di (8 pins), IO_ctrl (16 pins), LTE (35 pins), power (21 pins)
VBAT: LTE (6 pins), power (5 pins)
VCC_5V_ISO: ai (FB1.1 FB2.1 FB4.1), IO_ctrl (P5.15)